# EAGLE schematic LEDadapter00 (EAGLE 7.7.0)
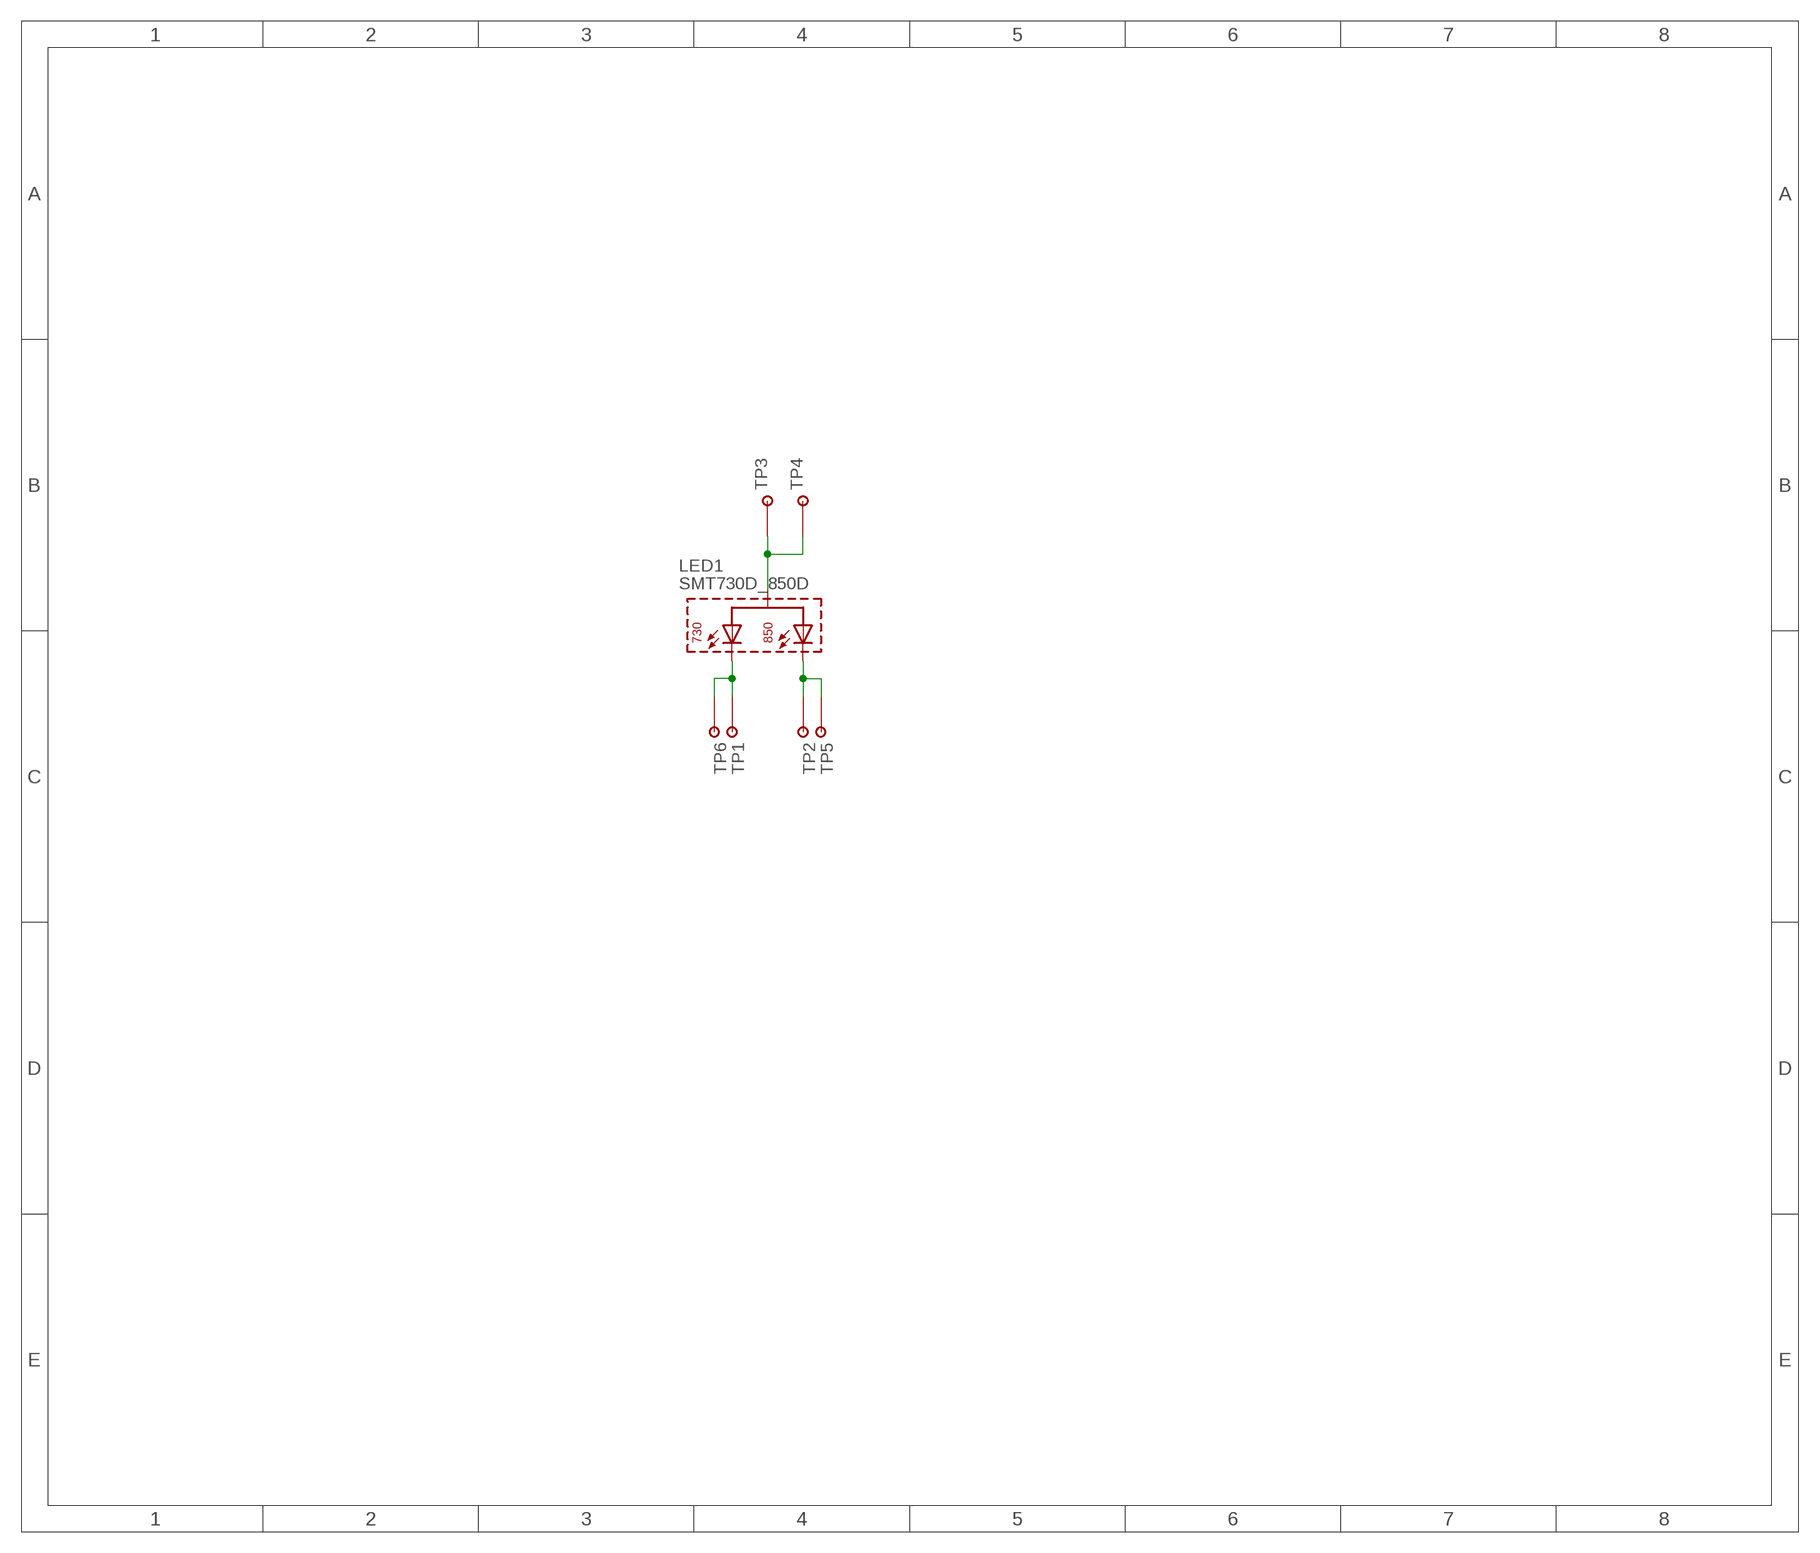
[diagram p0: schematic, sheet 1]

## Parts
LED1  SMT730D_850D  [SMT730D_850D]
TP1  TESTPOINT_PADMEDIUM  [TESTPAD_MEDIUM]
TP2  TESTPOINT_PADMEDIUM  [TESTPAD_MEDIUM]
TP3  TESTPOINT_PADMEDIUM  [TESTPAD_MEDIUM]
TP4  TESTPOINT_PADMEDIUM  [TESTPAD_MEDIUM]
TP5  TESTPOINT_PADMEDIUM  [TESTPAD_MEDIUM]
TP6  TESTPOINT_PADMEDIUM  [TESTPAD_MEDIUM]

## Nets
730: LED1.C7 TP1.P$1 TP6.P$1
850: LED1.C8 TP2.P$1 TP5.P$1
AN: LED1.A TP3.P$1 TP4.P$1

## Library data of the parts
LED1 = MyLib:SMT730D_850D
TP1-TP6 = MyLib:TESTPOINT